# Altium schematic sheet MCU.SchDoc
size A3
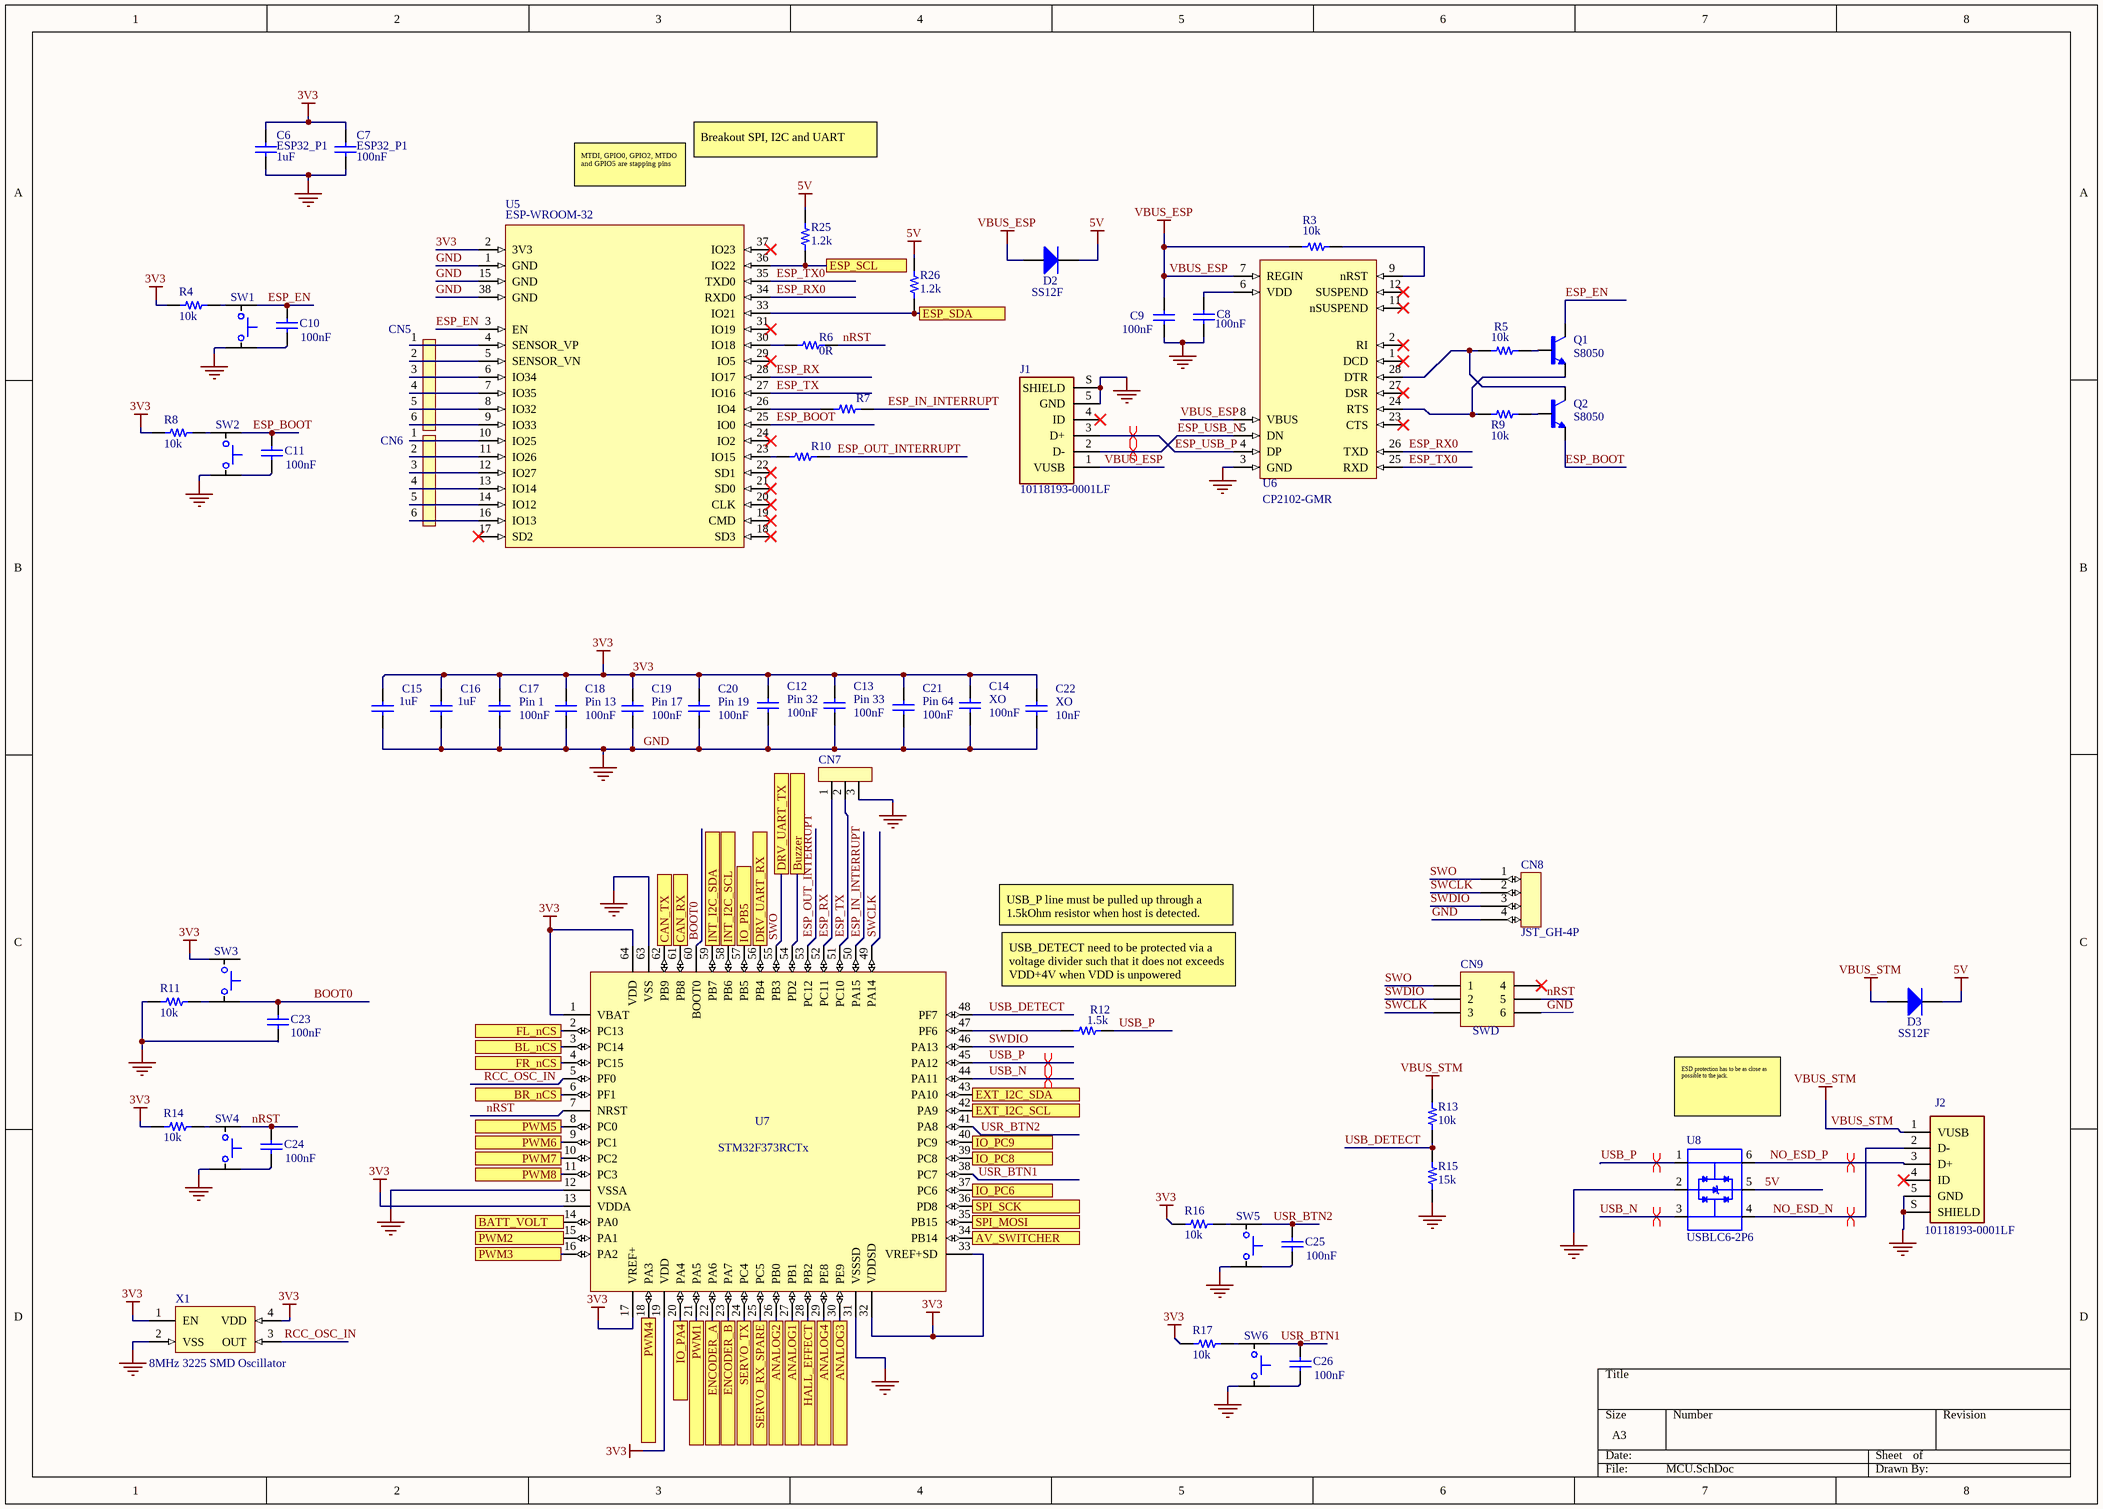
[diagram p0: MCU.SchDoc]

## Parts
C6  ESP32_P1  value 1uF  [0402]
C7  ESP32_P1  value 100nF  [0402]
C8  value 100nF  [0402]  (hidden comment: P6)
C9  value 100nF  [0402]  (hidden comment: P7)
C10  value 100nF  [0402]  (hidden comment: Cap)
C11  value 100nF  [0402]  (hidden comment: Cap)
C12  Pin 32  value 100nF  [0402]
C13  Pin 33  value 100nF  [0402]
C14  XO  value 100nF  [0402]
C15  value 1uF  [0402]
C16  value 1uF  [0402]
C17  Pin 1  value 100nF  [0402]
C18  Pin 13  value 100nF  [0402]
C19  Pin 17  value 100nF  [0402]
C20  Pin 19  value 100nF  [0402]
C21  Pin 64  value 100nF  [0402]
C22  XO  value 10nF  [0402]
C23  value 100nF  [0402]  (hidden comment: Cap)
C24  value 100nF  [0402]  (hidden comment: Cap)
C25  value 100nF  [0402]  (hidden comment: Cap)
C26  value 100nF  [0402]  (hidden comment: Cap)
CN5  6P-2.5mm  [6-Pin-Header]  (value not drawn)
CN6  6P-2.5mm  [6-Pin-Header]  (value not drawn)
CN7  3P-2.5mm  [2.5mm-3P]  (value not drawn)
CN8  JST_GH-4P  [JST_GH-4P]
CN9  SWD  [HDR2X3_CEN]
D2  SS12F  [SMAF_DIODE]
D3  SS12F  [SMAF_DIODE]
J1  10118193-0001LF  [FCI_10118193-0001LF]
J2  10118193-0001LF  [FCI_10118193-0001LF]
Q1  S8050  [SOT23-FET]
Q2  S8050  [SOT23-FET]
R3  10k  [0805 - duplicate]
R4  10k  [0805 - duplicate]
R5  10k  [0805 - duplicate]
R6  0R  [0805 - duplicate]
R7  1k  [0805 - duplicate]  (value not drawn)
R8  10k  [0805 - duplicate]
R9  10k  [0805 - duplicate]
R10  1k  [0805 - duplicate]  (value not drawn)
R11  10k  [0805 - duplicate]
R12  1.5k  [0805 - duplicate]
R13  10k  [2010_SMD_Resistor]
R14  10k  [0805 - duplicate]
R15  15k  [2010_SMD_Resistor]
R16  10k  [0805 - duplicate]
R17  10k  [0805 - duplicate]
R25  1.2k  [0805 - duplicate]
R26  1.2k  [0805 - duplicate]
SW1  SPST Switch  [4.8x4.8-SMD-SWITCH]  (value not drawn)
SW2  SPST Switch  [4.8x4.8-SMD-SWITCH]  (value not drawn)
SW3  SPST Switch  [4.8x4.8-SMD-SWITCH]  (value not drawn)
SW4  SPST Switch  [4.8x4.8-SMD-SWITCH]  (value not drawn)
SW5  USR_BTN2  [4.8x4.8-SMD-SWITCH]  (value not drawn)
SW6  USR_BTN1  [4.8x4.8-SMD-SWITCH]  (value not drawn)
U5  ESP-WROOM-32  [ESP-WROOM-32]
U6  CP2102-GMR  [QFN28G_0.5-5X5MM]
U7  STM32F373RCTx  [LQFP64]
U8  USBLC6-2P6  [SOT50P160X60-6N]
X1  8MHz 3225 SMD Oscillator  [3.2x2.5 SMD]

## Ports
ANALOG1, ANALOG2, ANALOG3, ANALOG4, AV_SWITCHER, BATT_VOLT, BL_nCS, BR_nCS, Buzzer, CAN_RX, CAN_TX, DRV_UART_RX, DRV_UART_TX, ENCODER_A, ENCODER_B, ESP_SCL, ESP_SDA, EXT_I2C_SCL, EXT_I2C_SDA, FL_nCS, FR_nCS, HALL_EFFECT, INT_I2C_SCL, INT_I2C_SDA, IO_PA4, IO_PB5, IO_PC6, IO_PC8, IO_PC9, PWM1, PWM2, PWM3, PWM4, PWM5, PWM6, PWM7, PWM8, SERVO_RX_SPARE, SERVO_TX, SPI_MOSI, SPI_SCK

## Nets
3V3: C6.2 C7.2 C12.2 C13.2 C14.2 C15.2 C16.2 C17.2 C18.2 C19.2 C20.2 C21.2 C22.2 R4.1 R8.1 R14.1 R16.1 R17.1 SW3.1 U5.2(3V3) U7.1(VBAT) U7.13(VDDA) U7.17(VREF+) U7.19(VDD) U7.32(VDDSD) U7.33(VREF+SD) U7.64(VDD) X1.1(EN) X1.4(VDD)
5V: D2.2(K) D3.2(K) R25.2 R26.2 U8.5(VBUS)
GND: C6.1 C7.1 C8.1 C9.1 C12.1 C13.1 C14.1 C15.1 C16.1 C17.1 C18.1 C19.1 C20.1 C21.1 C22.1 C23.2 CN7.3 CN8.4 CN9.6 J1.5(GND) J1.S(SHIELD) J2.5(GND) J2.S(SHIELD) R11.1 R15.1 SW1.3 SW2.3 SW4.3 SW5.3 SW6.3 U5.1(GND) U5.15(GND) U5.38(GND) U6.3(GND) U7.12(VSSA) U7.31(VSSSD) U7.63(VSS) U8.2(GND) X1.2(VSS)
VBUS_ESP: C9.2 D2.1(A) J1.1(VUSB) R3.1 U6.7(REGIN) U6.8(VBUS)
VBUS_STM: D3.1(A) J2.1(VUSB) R13.2
ANALOG1: U7.27(PB1) ; port ANALOG1
ANALOG2: U7.26(PB0) ; port ANALOG2
ANALOG3: U7.30(PE9) ; port ANALOG3
ANALOG4: U7.29(PE8) ; port ANALOG4
AV_SWITCHER: U7.34(PB14) ; port AV_SWITCHER
BATT_VOLT: U7.14(PA0) ; port BATT_VOLT
BL_nCS: U7.3(PC14) ; port BL_nCS
BOOT0: C23.1 SW3.4 U7.60(BOOT0)
BR_nCS: U7.6(PF1) ; port BR_nCS
Buzzer: U7.54(PD2) ; port Buzzer
CAN_RX: U7.61(PB8) ; port CAN_RX
CAN_TX: U7.62(PB9) ; port CAN_TX
DRV_UART_RX: U7.56(PB4) ; port DRV_UART_RX
ENCODER_A: U7.22(PA6) ; port ENCODER_A
ENCODER_B: U7.23(PA7) ; port ENCODER_B
ESP_BOOT: C11.2 Q2.2(E) SW2.2 U5.25(IO0)
ESP_EN: C10.2 Q1.3(C) SW1.2 U5.3(EN)
ESP_IN_INTERRUPT: R7.2 U7.50(PA15)
ESP_OUT_INTERRUPT: R10.2 U7.53(PC12)
ESP_RX: CN7.1 U5.28(IO17) U7.52(PC11)
ESP_RX0: U5.34(RXD0) U6.26(TXD)
ESP_SCL: R25.1 U5.36(IO22) ; port ESP_SCL
ESP_SDA: R26.1 U5.33(IO21) ; port ESP_SDA
ESP_TX: CN7.2 U5.27(IO16) U7.51(PC10)
ESP_TX0: U5.35(TXD0) U6.25(RXD)
ESP_USB_N: J1.2(D-) U6.5(DN)
ESP_USB_P: J1.3(D+) U6.4(DP)
EXT_I2C_SCL: U7.42(PA9) ; port EXT_I2C_SCL
EXT_I2C_SDA: U7.43(PA10) ; port EXT_I2C_SDA
FL_nCS: U7.2(PC13) ; port FL_nCS
FR_nCS: U7.4(PC15) ; port FR_nCS
HALL_EFFECT: U7.28(PB2) ; port HALL_EFFECT
INT_I2C_SCL: U7.58(PB6) ; port INT_I2C_SCL
INT_I2C_SDA: U7.59(PB7) ; port INT_I2C_SDA
IO_PA4: U7.20(PA4) ; port IO_PA4
IO_PB5: U7.57(PB5) ; port IO_PB5
IO_PC6: U7.37(PC6) ; port IO_PC6
IO_PC8: U7.39(PC8) ; port IO_PC8
IO_PC9: U7.40(PC9) ; port IO_PC9
NO_ESD_N: J2.2(D-) U8.4(I/O2_2)
NO_ESD_P: J2.3(D+) U8.6(I/O1_2)
nRST: C24.2 CN9.5 R6.2 SW4.2 U7.7(NRST)
PWM1: U7.21(PA5) ; port PWM1
PWM2: U7.15(PA1) ; port PWM2
PWM3: U7.16(PA2) ; port PWM3
PWM4: U7.18(PA3) ; port PWM4
PWM5: U7.8(PC0) ; port PWM5
PWM6: U7.9(PC1) ; port PWM6
PWM7: U7.10(PC2) ; port PWM7
PWM8: U7.11(PC3) ; port PWM8
RCC_OSC_IN: U7.5(PF0) X1.3(OUT)
SERVO_RX_SPARE: U7.25(PC5) ; port SERVO_RX_SPARE
SERVO_TX: U7.24(PC4) ; port SERVO_TX
SPI_MOSI: U7.35(PB15) ; port SPI_MOSI
SPI_SCK: U7.36(PD8) ; port SPI_SCK
SWCLK: CN8.2 CN9.3 U7.49(PA14)
SWDIO: CN8.3 CN9.2 U7.46(PA13)
SWO: CN8.1 CN9.1 U7.55(PB3) ; port DRV_UART_TX
USB_DETECT: R13.1 R15.2 U7.48(PF7)
USB_N: U7.44(PA11) U8.3(I/O2_1)
USB_P: R12.2 U7.45(PA12) U8.1(I/O1_1)
USR_BTN1: C26.2 SW6.2 U7.38(PC7)
USR_BTN2: C25.2 SW5.2 U7.41(PA8)
NetC8_2: C8.2 U6.6(VDD)
NetC10_1: C10.1 SW1.4
NetC11_1: C11.1 SW2.4
NetC24_1: C24.1 SW4.4
NetC25_1: C25.1 SW5.4
NetC26_1: C26.1 SW6.4
NetCN5_1: CN5.1 U5.4(SENSOR_VP)
NetCN5_2: CN5.2 U5.5(SENSOR_VN)
NetCN5_3: CN5.3 U5.6(IO34)
NetCN5_4: CN5.4 U5.7(IO35)
NetCN5_5: CN5.5 U5.8(IO32)
NetCN5_6: CN5.6 U5.9(IO33)
NetCN6_1: CN6.1 U5.10(IO25)
NetCN6_2: CN6.2 U5.11(IO26)
NetCN6_3: CN6.3 U5.12(IO27)
NetCN6_4: CN6.4 U5.13(IO14)
NetCN6_5: CN6.5 U5.14(IO12)
NetCN6_6: CN6.6 U5.16(IO13)
NetQ1_1: Q1.1(B) R5.2
NetQ1_2: Q1.2(E) R9.1 U6.24(RTS)
NetQ2_1: Q2.1(B) R9.2
NetQ2_3: Q2.3(C) R5.1 U6.28(DTR)
NetR3_2: R3.2 U6.9(nRST)
NetR4_2: R4.2 SW1.1
NetR6_1: R6.1 U5.30(IO18)
NetR7_1: R7.1 U5.26(IO4)
NetR8_2: R8.2 SW2.1
NetR10_1: R10.1 U5.23(IO15)
NetR11_2: R11.2 SW3.3
NetR12_1: R12.1 U7.47(PF6)
NetR14_2: R14.2 SW4.1
NetR16_2: R16.2 SW5.1
NetR17_2: R17.2 SW6.1

Not connected (* = marked no-connect by the designer): CN9 4*; J1 4(ID)*; J2 4(ID)*; SW3 2; U5 17(SD2)* 18(SD3)* 19(CMD)* 20(CLK)* 21(SD0)* 22(SD1)* 24(IO2)* 29(IO5)* 31(IO19)* 37(IO23)*; U6 1(DCD)* 2(RI)* 11(nSUSPEND)* 12(SUSPEND)* 23(CTS)* 27(DSR)*

## Layout directives
differential pair: ESP_USB_N, ESP_USB_P, NO_ESD_N, NO_ESD_P, USB_N, USB_P

## Notes on the sheet
- MTDI, GPIO0, GPIO2, MTDO and GPIO5 are stapping pins
- Breakout SPI, I2C and UART
- USB_P line must be pulled up through a 1.5kOhm resistor when host is detected.
- USB_DETECT need to be protected via a voltage divider such that it does not exceeds VDD+4V when VDD is unpowered
- (near U8) ESD protection has to be as close as possible to the jack.

## Library data of the parts
C6-C9 C12-C22 = Cap: Published: 8-Jun-2000; LatestRevisionDate: 17-Jul-2002; LatestRevisionNote: Re-released for DXP Platform.; PackageReference: RAD-0.3; Publisher: Altium Limited; PackageDescription: Radial Cap, Thru-Hole; 2 Leads; 0.3 in Pin Spacing
CN9 = Header 3X2A: Header, 3-Pin, Dual row; LatestRevisionDate: 17-Jul-2002; LatestRevisionNote: Re-released for DXP Platform.; Publisher: Altium Limited
J1 J2 = 10118193-0001LF: USB - micro B USB 2.0 Receptacle Connector 5 Position Surface Mount, Right Angle; Through Hole; MF: Amphenol ICC; Availability: Unavailable; SnapEDA_Link: https://www.snapeda.com/parts/10118193-0001LF/Amphenol%20FCI/view-part/2758989/?ref=snap; MP: 10118193-0001LF; Price: None; Value: *; Package: None
Q1 Q2 = S8050: MF: MICROSS/On Semiconductor; MP: 2N2222; Value: *; Package: TO-18-3 NJS; Digi-Key_Purchase_URL: https://www.digikey.com.mx/product-detail/en/microsemi-corporation/JANS2N2222A/1086-15156-ND/4384334?utm_source=snapeda&utm_medium=aggregator&utm_campaign=symbol; SnapEDA_Link: https://www.snapeda.com/parts/2N2222/MICROSS/On%20Semiconductor/view-part/561967/?ref=snap; Digi-Key_Part_Number: 1086-15156-ND
R3-R17 R25 R26 = Resistor
SW5 SW6 = SPST Switch
U5 = ESP-WROOM-32: WiFi 802.11b/g/n/d/e/i Transceiver Module 2.4GHz Surface Mount; MF: Olimex LTD; SnapEDA_Link: https://www.snapeda.com/parts/ESP-WROOM-32/Olimex%20LTD/view-part/2311927/?ref=snap; Package: Module Olimex LTD; MP: ESP-WROOM-32; Availability: Unavailable; Price: None; Value: *
U8 = USBLC6-2P6: 17V Clamp 5A _8/20µs_ Ipp Tvs Diode Surface Mount SOT-666; MF: STMicroelectronics; Value: *; MP: USBLC6-2P6; SnapEDA_Link: https://www.snapeda.com/parts/USBLC6-2P6/STMicroelectronics/view-part/106846/?ref=snap; Availability: Unavailable; Price: None; Package: SOT-563 STMicroelectronics
C10 C11 C23-C26 = Cap: Published: 8-Jun-2000; LatestRevisionDate: 17-Jul-2002; LatestRevisionNote: Re-released for DXP Platform.; PackageReference: RAD-0.3; Publisher: Altium Limited; PackageDescription: Radial Cap, Thru-Hole; 2 Leads; 0.3 in Pin Spacing